# Altium schematic sheet ft2232hq.SchDoc
size A4; SheetNumber: 1; SheetTotal: 1; SPICEModelCacheSJJFNHZY: <root> / <DocumentId>SJJFNHZY</DocumentId> / </root>
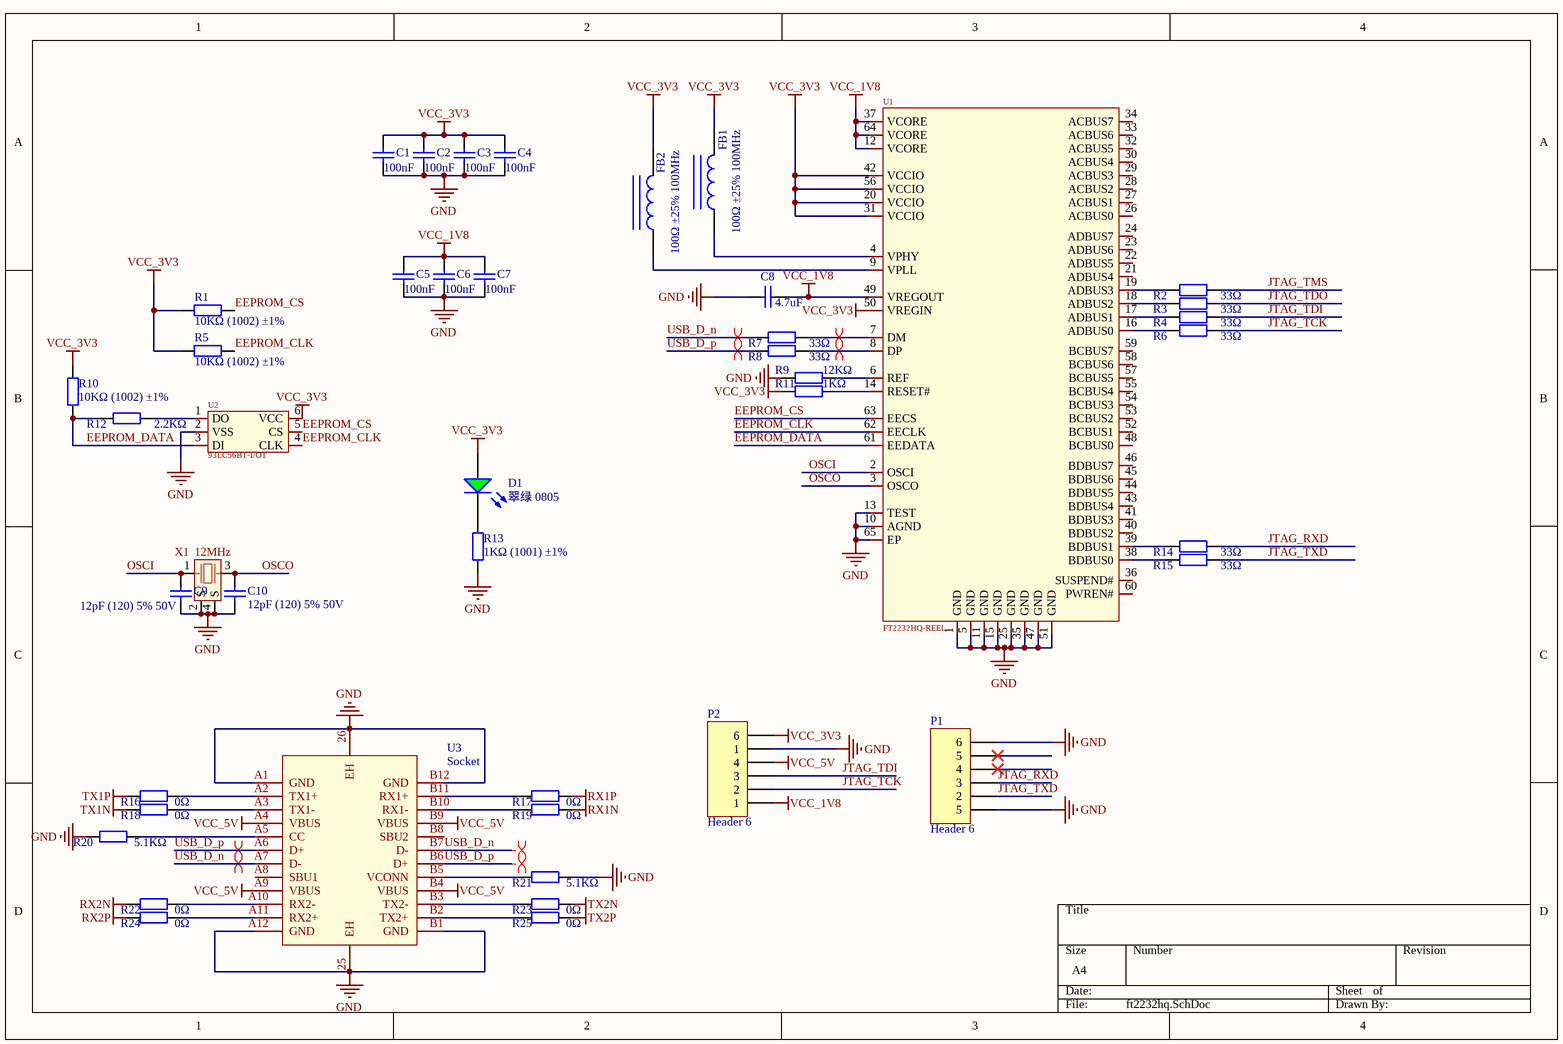
[diagram p0: ft2232hq.SchDoc]

## Parts
C1  100nF  [0805_C]
C2  100nF  [0805_C]
C3  100nF  [0805_C]
C4  100nF  [0805_C]
C5  100nF  [0805_C]
C6  100nF  [0805_C]
C7  100nF  [0805_C]
C8  4.7uF  [0805_C]
C9  12pF (120) 5% 50V  [0805_C]
C10  12pF (120) 5% 50V  [0805_C]
D1  翠绿 0805  [0805_LED_S1]
FB1  100Ω ±25% 100MHz  [0805_L]
FB2  100Ω ±25% 100MHz  [0805_L]
P1  Header 6  [HDR1X6]
P2  Header 6  [HDR1X6]
R1  10KΩ (1002) ±1%  [0805_R]
R2  33Ω  [0805_R]
R3  33Ω  [0805_R]
R4  33Ω  [0805_R]
R5  10KΩ (1002) ±1%  [0805_R]
R6  33Ω  [0805_R]
R7  33Ω  [0805_R]
R8  33Ω  [0805_R]
R9  12KΩ  [0805_R]
R10  10KΩ (1002) ±1%  [0805_R]
R11  1KΩ  [0805_R]
R12  2.2KΩ  [0805_R]
R13  1KΩ (1001) ±1%  [0805_R]
R14  33Ω  [0805_R]
R15  33Ω  [0805_R]
R16  0Ω  [0402_R]
R17  0Ω  [0402_R]
R18  0Ω  [0402_R]
R19  0Ω  [0402_R]
R20  5.1KΩ  [0805_R]
R21  5.1KΩ  [0805_R]
R22  0Ω  [0402_R]
R23  0Ω  [0402_R]
R24  0Ω  [0402_R]
R25  0Ω  [0402_R]
U1  FT2232HQ-REEL  [QFN-64_L9.0-W9.0-P0.50-TL-EP4.3]
U2  93LC56BT-I/OT  [SOT-23-6_L2.9-W1.6-P0.95-LS2.8-BR]
U3  Socket  [USB Type C 贴片 24P]
X1  12MHz  [3225]

## Nets
GND: C1.1 C2.1 C3.1 C4.1 C5.1 C6.1 C7.1 C8.1 C9.1 C10.1 P1.5 P1.6 P2.1 R9.1 R13.1 R20.1 R21.2 U1.1(GND) U1.5(GND) U1.10(AGND) U1.11(GND) U1.13(TEST) U1.15(GND) U1.25(GND) U1.35(GND) U1.47(GND) U1.51(GND) U1.65(EP) U2.2(VSS) U3.25(EH) U3.26(EH) U3.A1(GND) U3.A12(GND) U3.B1(GND) U3.B12(GND) X1.2(S) X1.4(S)
RX1N: R19.2
RX1P: R17.2
RX2N: R22.1
RX2P: R24.1
TX1N: R18.1
TX1P: R16.1
TX2N: R23.2
TX2P: R25.2
VCC_1V8: C5.2 C6.2 C7.2 C8.2 P2.1 U1.12(VCORE) U1.37(VCORE) U1.49(VREGOUT) U1.64(VCORE)
VCC_3V3: C1.2 C2.2 C3.2 C4.2 D1.A FB1.2 FB2.2 P2.6 R1.2 R5.2 R10.2 R11.1 U1.20(VCCIO) U1.31(VCCIO) U1.42(VCCIO) U1.50(VREGIN) U1.56(VCCIO) U2.6(VCC)
VCC_5V: P2.4 U3.A4(VBUS) U3.A9(VBUS) U3.B4(VBUS) U3.B9(VBUS)
EEPROM_CLK: R5.1 U1.62(EECLK) U2.4(CLK)
EEPROM_CS: R1.1 U1.63(EECS) U2.5(CS)
EEPROM_DATA: R10.1 R12.1 U1.61(EEDATA) U2.3(DI)
JTAG_RXD: P1.3 R14.2
JTAG_TCK: P2.2 R6.2
JTAG_TDI: P2.3 R4.2
JTAG_TDO: R3.2
JTAG_TMS: R2.2
JTAG_TXD: P1.2 R15.2
OSCI: C9.2 U1.2(OSCI) X1.1
OSCO: C10.2 U1.3(OSCO) X1.3
USB_D_n: R7.1 U3.A7(D-) U3.B7(D-)
USB_D_p: R8.1 U3.A6(D+) U3.B6(D+)
NetD1_K: D1.K R13.2
NetFB1_1: FB1.1 U1.4(VPHY)
NetFB2_1: FB2.1 U1.9(VPLL)
NetR2_1: R2.1 U1.19(ADBUS3)
NetR3_1: R3.1 U1.18(ADBUS2)
NetR4_1: R4.1 U1.17(ADBUS1)
NetR6_1: R6.1 U1.16(ADBUS0)
NetR7_2: R7.2 U1.7(DM)
NetR8_2: R8.2 U1.8(DP)
NetR9_2: R9.2 U1.6(REF)
NetR11_2: R11.2 U1.14(RESET#)
NetR12_2: R12.2 U2.1(DO)
NetR14_1: R14.1 U1.39(BDBUS1)
NetR15_1: R15.1 U1.38(BDBUS0)
NetR16_2: R16.2 U3.A2(TX1+)
NetR17_1: R17.1 U3.B11(RX1+)
NetR18_2: R18.2 U3.A3(TX1-)
NetR19_1: R19.1 U3.B10(RX1-)
NetR20_2: R20.2 U3.A5(CC)
NetR21_1: R21.1 U3.B5(VCONN)
NetR22_2: R22.2 U3.A10(RX2-)
NetR23_1: R23.1 U3.B3(TX2-)
NetR24_2: R24.2 U3.A11(RX2+)
NetR25_1: R25.1 U3.B2(TX2+)

Not connected (* = marked no-connect by the designer): P1 4*; U1 21(ADBUS4) 22(ADBUS5) 23(ADBUS6) 24(ADBUS7) 26(ACBUS0) 27(ACBUS1) 28(ACBUS2) 29(ACBUS3) 30(ACBUS4) 32(ACBUS5) 33(ACBUS6) 34(ACBUS7) 36(SUSPEND#) 40(BDBUS2) 41(BDBUS3) 43(BDBUS4) 44(BDBUS5) 45(BDBUS6) 46(BDBUS7) 48(BCBUS0) 52(BCBUS1) 53(BCBUS2) 54(BCBUS3) 55(BCBUS4) 57(BCBUS5) 58(BCBUS6) 59(BCBUS7) 60(PWREN#); U3 A8(SBU1) B8(SBU2)

## Layout directives
differential pair: NetR7_2, NetR8_2, USB_D_n, USB_D_p

## Library data of the parts
C1-C7 = 0805 100nF(104) 10% 50V: 贴片电容; ComponentLink1Description: 供应商链接; ComponentLink1URL: http://www.szlcsc.com/product/details_50686.html; Package: 0805; Supplier: LC; SuppliersPartNumber: C49678
C8 = 0805 4.7uF (475) 10% 25V: 贴片电容; ComponentLink1Description: 供应商链接; ComponentLink1URL: http://www.szlcsc.com/product/details_2131.html; Package: 0805; Supplier: LC; SuppliersPartNumber: C1779
C9 C10 = 0805 12pF (120) 5% 50V: 贴片电容; ComponentLink1Description: 供应商链接; ComponentLink1URL: http://www.szlcsc.com/product/details_2144.html; Package: 0805; Supplier: LC; SuppliersPartNumber: C1792
D1 = 0805 翠绿: 发光二极管; ComponentLink1Description: 供应商链接; ComponentLink1URL: http://www.szlcsc.com/product/details_2670.html; Package: 0805; Supplier: LC; SuppliersPartNumber: C2297
FB1 FB2 = 0805 100Ω 25% 100MHz: 贴片磁珠; ComponentLink1Description: 供应商链接; ComponentLink1URL: http://www.szlcsc.com/product/details_1367.html; Package: 0805; Supplier: LC; SuppliersPartNumber: C1015
P1 P2 = Header 6: Header, 6-Pin; LatestRevisionDate: 17-Jul-2002; LatestRevisionNote: Re-released for DXP Platform.; Publisher: Altium Limited
R1 R5 R10 = 0805 10KΩ (1002) 1%: 贴片电阻; ComponentLink1Description: 供应商链接; ComponentLink1URL: http://www.szlcsc.com/product/details_18102.html; Package: 0805; Supplier: LC; SuppliersPartNumber: C17414
R2-R4 R6-R8 R14 R15 = 0805 33Ω (33R0) 1%: 贴片电阻; ComponentLink1Description: 供应商链接; ComponentLink1URL: http://www.szlcsc.com/product/details_18322.html; Package: 0805; Supplier: LC; SuppliersPartNumber: C17634
R9 = 0805 12KΩ (1202) 1%: 贴片电阻; ComponentLink1Description: 供应商链接; ComponentLink1URL: http://www.szlcsc.com/product/details_18132.html; Package: 0805; Supplier: LC; SuppliersPartNumber: C17444
R11 R13 = 0805 1KΩ (1001) 1%: 贴片电阻; ComponentLink1Description: 供应商链接; ComponentLink1URL: http://www.szlcsc.com/product/details_18201.html; Package: 0805; Supplier: LC; SuppliersPartNumber: C17513
R12 = 0805 2.2KΩ (2201) 1%: 贴片电阻; ComponentLink1Description: 供应商链接; ComponentLink1URL: http://www.szlcsc.com/product/details_18208.html; Package: 0805; Supplier: LC; SuppliersPartNumber: C17520
R16-R19 R22-R25 = 0402 0Ω (0R0) 1%: 贴片电阻; ComponentLink1Description: 供应商链接; ComponentLink1URL: http://www.szlcsc.com/product/details_17853.html; Package: 0402; Supplier: LC; SuppliersPartNumber: C17168
R20 R21 = 0805 5.1KΩ (5101) 1%: 贴片电阻; ComponentLink1Description: 供应商链接; ComponentLink1URL: http://www.szlcsc.com/product/details_28584.html; Package: 0805; Supplier: LC; SuppliersPartNumber: C27834
U1 = FT2232HQ-REEL: Manufacturer: FTDI(飞特帝亚); Add into BOM: yes; Applications Function: USB转UART；USB转FIFO; Supply Voltage: 3V~3.6V; Symbol: FT2232HQ-REEL; Device: FT2232HQ-REEL; LCSC Part Name: FT2232H 双高速 USB 转多用途 UART/FIFO IC; Supplier Part: C193662; Manufacturer Part: FT2232HQ-REEL; Supplier Footprint: QFN-64-EP(9x9); JLCPCB Part Class: Extended Part; Datasheet: https://atta.szlcsc.com/upload/public/pdf/source/20180530/C193662_F14B45A4B5271BE746E436B0F2E041EE.pdf; Supplier: LCSC; Convert to PCB: yes; Protocol: -; Operating Temperature: -40℃~+85℃
U2 = 93LC56BT-I/OT: Manufacturer: MICROCHIP(美国微芯); Add into BOM: yes; Interface Type: SPI; Memory Size: 2Kbit; Supply Voltage: 2.5V~5.5V; Write Cycle Time (Tw): 6ms; Data Retention - TDR (Year): 200年; Write Cycle Endurance: 1000000次; Symbol: 93LC56BT-I/OT; Device: 93LC56BT-I/OT; LCSC Part Name: 93LC56BT-I/OT; Supplier Part: C190271; Manufacturer Part: 93LC56BT-I/OT; Supplier Footprint: SOT-23-6; JLCPCB Part Class: Extended Part; Datasheet: https://atta.szlcsc.com/upload/public/pdf/source/20140724/1457707164359.pdf; Supplier: LCSC; Convert to PCB: yes; Operating Temperature: -40℃~+85℃
U3 = USB type C 沉板公头
X1 = 四脚无源晶体: 4脚贴片无源晶体; Manufacturer: YJX(雅晶鑫); Symbol: TAXM8M4RDBCCT2T; Add into BOM: yes; Value: 8MHz; Normal temperature Frequency Tolerance: ±10ppm; Load Capacitance: 10pF; Frequency Stability: ±15ppm; Equivalent Series Resistance(ESR): 250Ω; Device: TAXM8M4RDBCCT2T; LCSC Part Name: 8MHz ±10ppm 10pF; Supplier Part: C400090; Manufacturer Part: TAXM8M4RDBCCT2T; Supplier Footprint: SMD3225-4P; JLCPCB Part Class: Extended Part; Datasheet: https://atta.szlcsc.com/upload/public/pdf/source/20190626/C400090_CF95B89E745AFE4EF2E392EF8AC009D6.pdf; Supplier: LCSC; Convert to PCB: yes; Type: 贴片晶振; Operating Temperature: -40℃~+85℃